# EAGLE schematic esp32_logging (EAGLE 9.6.2)

## Sheet 1 of 2
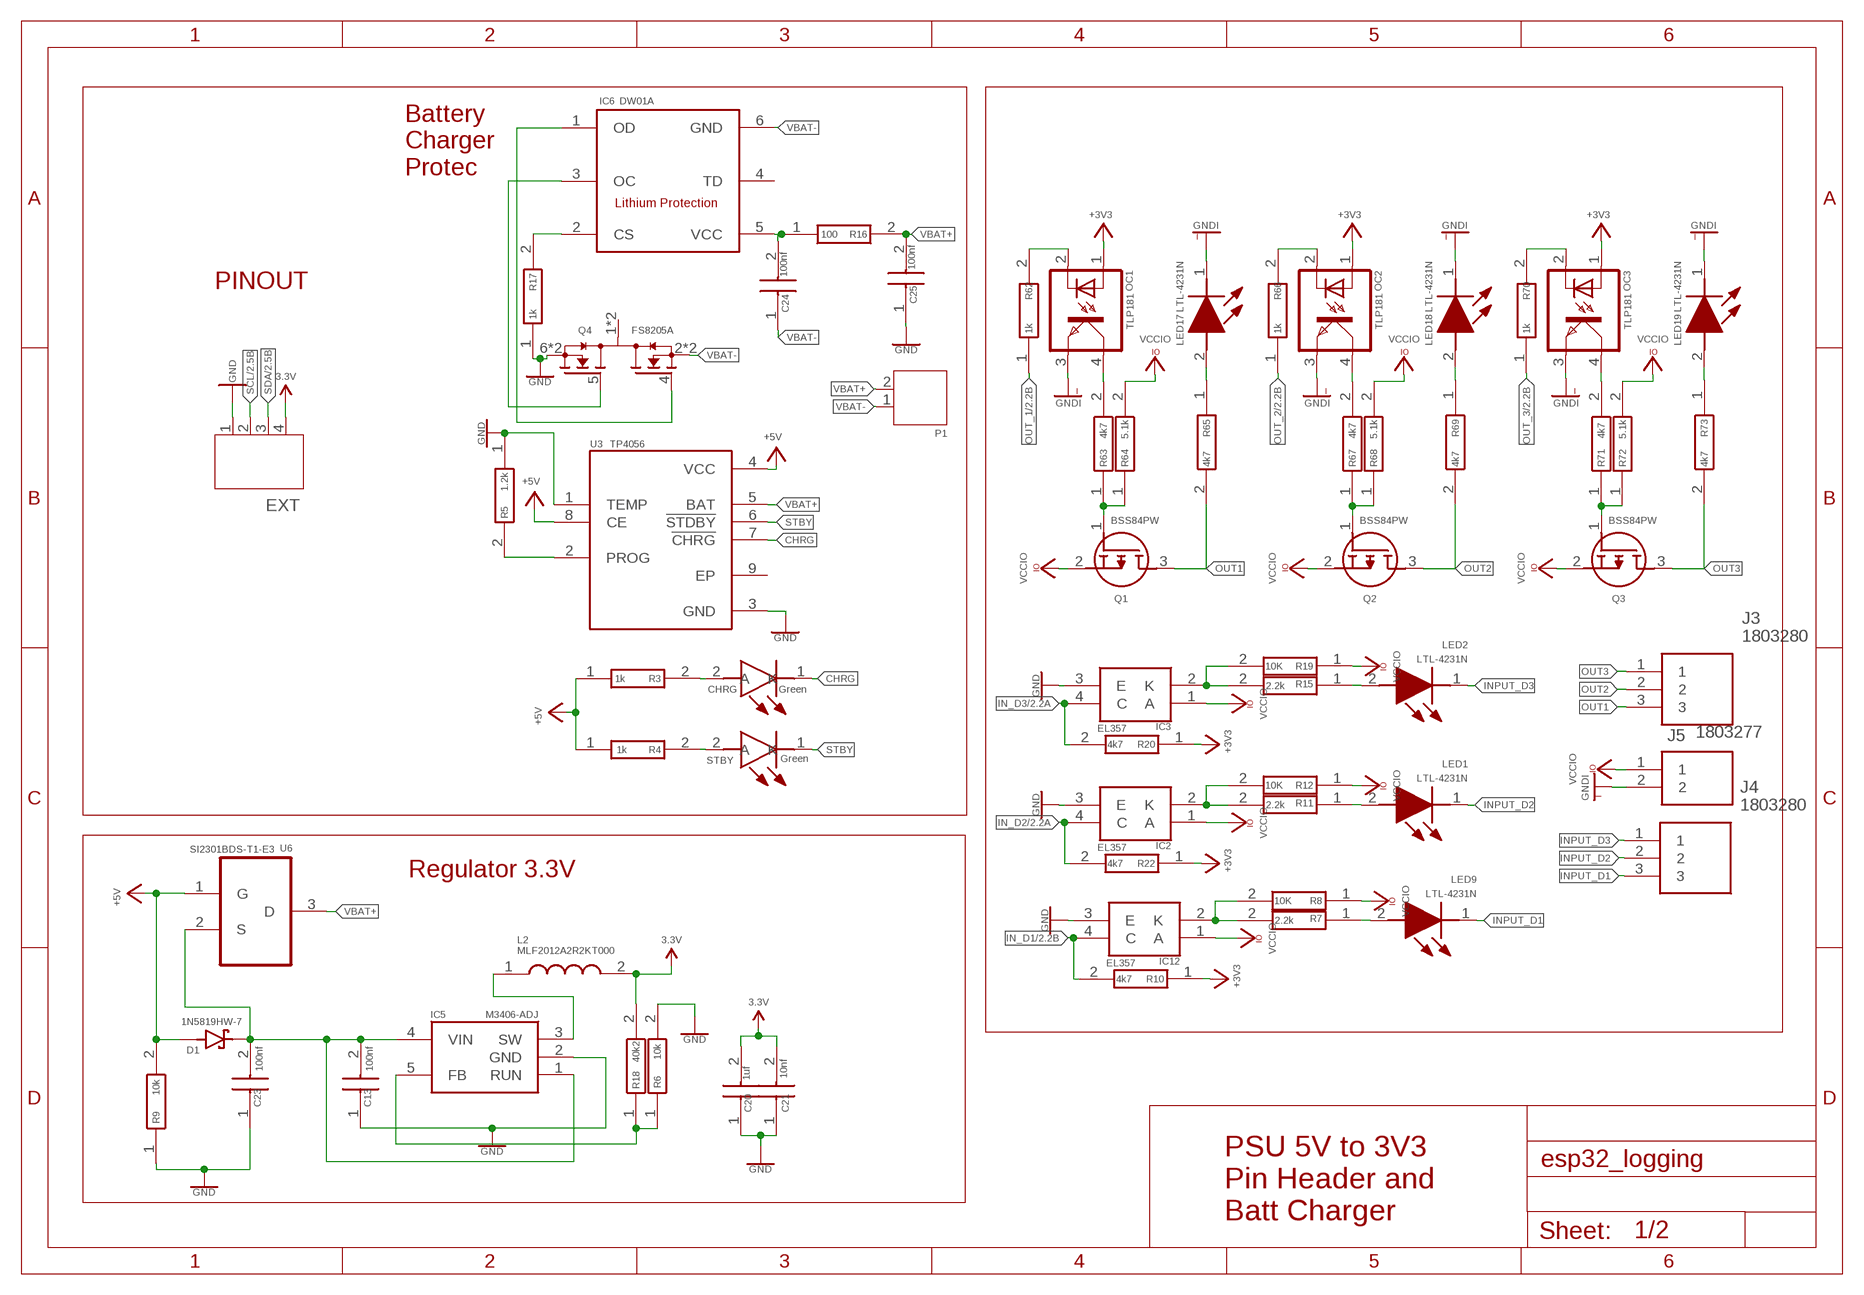
[diagram p0: schematic, sheet 1]

### Parts
C13  100nf  885012206071  [CAPC1608X87N]
C20  1uf  885012206071  [CAPC1608X87N]
C21  10nf  885012206089  [CAPC1608X87N]
C23  100nf  885012206071  [CAPC1608X87N]
C24  100nf  885012206071  [CAPC1608X87N]
C25  100nf  885012206071  [CAPC1608X87N]
CHRG  Green  150080BS75000  [LEDC2012X80N]
D1  1N5819HW-7  [SOD3715X145N]
EXT  JST-PH4  [JST-PH4]
IC2  EL357  [EL357]
IC3  EL357  [EL357]
IC5  M3406-ADJ  [SOT95P280X100-5N]
IC6  DW01A  [SOT23-6]
IC12  EL357  [EL357]
J3  1803280  [1803280]
J4  1803280  [1803280]
J5  1803277  [1803277]
L2  MLF2012A2R2KT000  [INDC2012X105N]
LED1  LTL-4231N  [LTL4231N]
LED2  LTL-4231N  [LTL4231N]
LED9  LTL-4231N  [LTL4231N]
LED17  LTL-4231N  [LTL4231N]
LED18  LTL-4231N  [LTL4231N]
LED19  LTL-4231N  [LTL4231N]
OC1  TLP181  [SO-4]
OC2  TLP181  [SO-4]
OC3  TLP181  [SO-4]
P1  JST-PH2  [JST-PH2]
Q1  BSS84PW  BSS84PW_H6327  [SOT65P210X100-3N]
Q2  BSS84PW  BSS84PW_H6327  [SOT65P210X100-3N]
Q3  BSS84PW  BSS84PW_H6327  [SOT65P210X100-3N]
Q4  FS8205A  [SOP65P640X120-8N]
R3  1k  ESR03EZPJ102  [RESC1608X55N]
R4  1k  ESR03EZPJ102  [RESC1608X55N]
R5  1.2k  ESR03EZPJ102  [RESC1608X55N]
R6  10k  ESR03EZPJ103  [RESC1608X55N]
R7  2.2k  CR0805-FX-2201ELF  [RESC2012X60N]
R8  10K  RT0603DRE0710KL  [RESC1608X55N]
R9  10k  ESR03EZPJ103  [RESC1608X55N]
R10  4k7  ERA-3AED472V  [ERA3AEB101V]
R11  2.2k  CR0805-FX-2201ELF  [RESC2012X60N]
R12  10K  RT0603DRE0710KL  [RESC1608X55N]
R15  2.2k  CR0805-FX-2201ELF  [RESC2012X60N]
R16  100  ESR03EZPJ102  [RESC1608X55N]
R17  1k  ESR03EZPJ102  [RESC1608X55N]
R18  40k2  ERJ-S03F4022V  [RESC1608X55N]
R19  10K  RT0603DRE0710KL  [RESC1608X55N]
R20  4k7  ERA-3AED472V  [ERA3AEB101V]
R22  4k7  ERA-3AED472V  [ERA3AEB101V]
R62  1k  ESR03EZPJ102  [RESC1608X55N]
R63  4k7  ERA-3AED472V  [ERA3AEB101V]
R64  5.1k  ERJ-S03J512V  [RESC1608X55N]
R65  4k7  ERA-3AED472V  [ERA3AEB101V]
R66  1k  ESR03EZPJ102  [RESC1608X55N]
R67  4k7  ERA-3AED472V  [ERA3AEB101V]
R68  5.1k  ERJ-S03J512V  [RESC1608X55N]
R69  4k7  ERA-3AED472V  [ERA3AEB101V]
R70  1k  ESR03EZPJ102  [RESC1608X55N]
R71  4k7  ERA-3AED472V  [ERA3AEB101V]
R72  5.1k  ERJ-S03J512V  [RESC1608X55N]
R73  4k7  ERA-3AED472V  [ERA3AEB101V]
STBY  Green  150080BS75000  [LEDC2012X80N]
U3  TP4056  [SOP127P600X175-9N]
U6  SI2301BDS-T1-E3  [SOT95P237X112-3N]

### Nets
3.3V: C20.2 C21.2 EXT.4 L2.2 OC1.1(A) OC2.1(A) OC3.1(A) R10.1 R18.2 R20.1 R22.1 ; supply symbol labelled +3V3 ; also sheet 2
+5V: D1.A R3.1 R4.1 R9.2 U3.4(VCC) U3.8(CE) U6.1(G) ; also sheet 2
CHRG: CHRG.1(K) U3.7(!CHRG)
GND: C13.1 C20.1 C21.1 C23.1 C25.1 EXT.1 IC2.3(E) IC3.3(E) IC5.2(GND) IC12.3(E) Q4.6(S2) Q4.7(S2) R5.1 R6.2 R9.1 R17.1 U3.1(TEMP) U3.3(GND) ; also sheet 2
GNDI: J5.2 LED17.1(K) LED18.1(K) LED19.1(K) OC1.3(EMIT) OC2.3(EMIT) OC3.3(EMIT)
IN_D1: IC12.4(C) R10.2 ; also sheet 2
IN_D2: IC2.4(C) R22.2 ; also sheet 2
IN_D3: IC3.4(C) R20.2 ; also sheet 2
INPUT_D1: J4.3 LED9.1(K)
INPUT_D2: J4.2 LED1.1(K)
INPUT_D3: J4.1 LED2.1(K)
N$1: C13.2 C23.2 D1.C(K) IC5.1(RUN) IC5.4(VIN) U6.2(S)
N$3: C24.2 IC6.5(VCC) R16.1
N$4: R4.2 STBY.2(A)
N$6: R5.2 U3.2(PROG)
N$8: IC6.1(OD) Q4.4(G1)
N$10: IC5.3(SW) L2.1
N$13: IC2.2(K) R11.2 R12.2
N$14: IC12.2(K) R7.2 R8.2
N$15: CHRG.2(A) R3.2
N$16: LED1.2(A) R11.1
N$17: IC3.2(K) R15.2 R19.2
N$18: LED2.2(A) R15.1
N$20: OC1.4(COL) R63.2
N$21: IC6.2(CS) R17.2
N$22: IC5.5(FB) R6.1 R18.1
N$26: IC6.3(OC) Q4.5(G2)
N$30: OC1.2(C) R62.2
N$31: Q1.1(G) R63.1 R64.1
N$32: OC2.4(COL) R67.2
N$33: LED17.2(A) R65.1
N$35: OC2.2(C) R66.2
N$36: Q2.1(G) R67.1 R68.1
N$37: LED18.2(A) R69.1
N$38: OC3.4(COL) R71.2
N$39: OC3.2(C) R70.2
N$40: Q3.1(G) R71.1 R72.1
N$41: LED19.2(A) R73.1
N$121: LED9.2(A) R7.1
OUT1: J3.3 Q1.3(D) R65.2
OUT2: J3.2 Q2.3(D) R69.2
OUT3: J3.1 Q3.3(D) R73.2
OUT_1: R62.1 ; also sheet 2
OUT_2: R66.1 ; also sheet 2
OUT_3: R70.1 ; also sheet 2
SCL: EXT.2 ; also sheet 2
SDA: EXT.3 ; also sheet 2
STBY: STBY.1(K) U3.6(!STDBY)
VBAT+: C25.2 P1.2 R16.2 U3.5(BAT) U6.3(D)
VBAT-: C24.1 IC6.6(GND) P1.1 Q4.2(S1) Q4.3(S1)
VCCIO: IC2.1(A) IC3.1(A) IC12.1(A) J5.1 Q1.2(S) Q2.2(S) Q3.2(S) R8.1 R12.1 R19.1 R64.2 R68.2 R72.2
Unconnected: IC6.4(TD) Q4.1(D12) Q4.8(D12) U3.9(EP)

### Notes on the sheet
- Battery 
  Charger
  Protec
- PINOUT
- Regulator 3.3V
- PSU 5V to 3V3
  Pin Header and
  Batt Charger

## Sheet 2 of 2
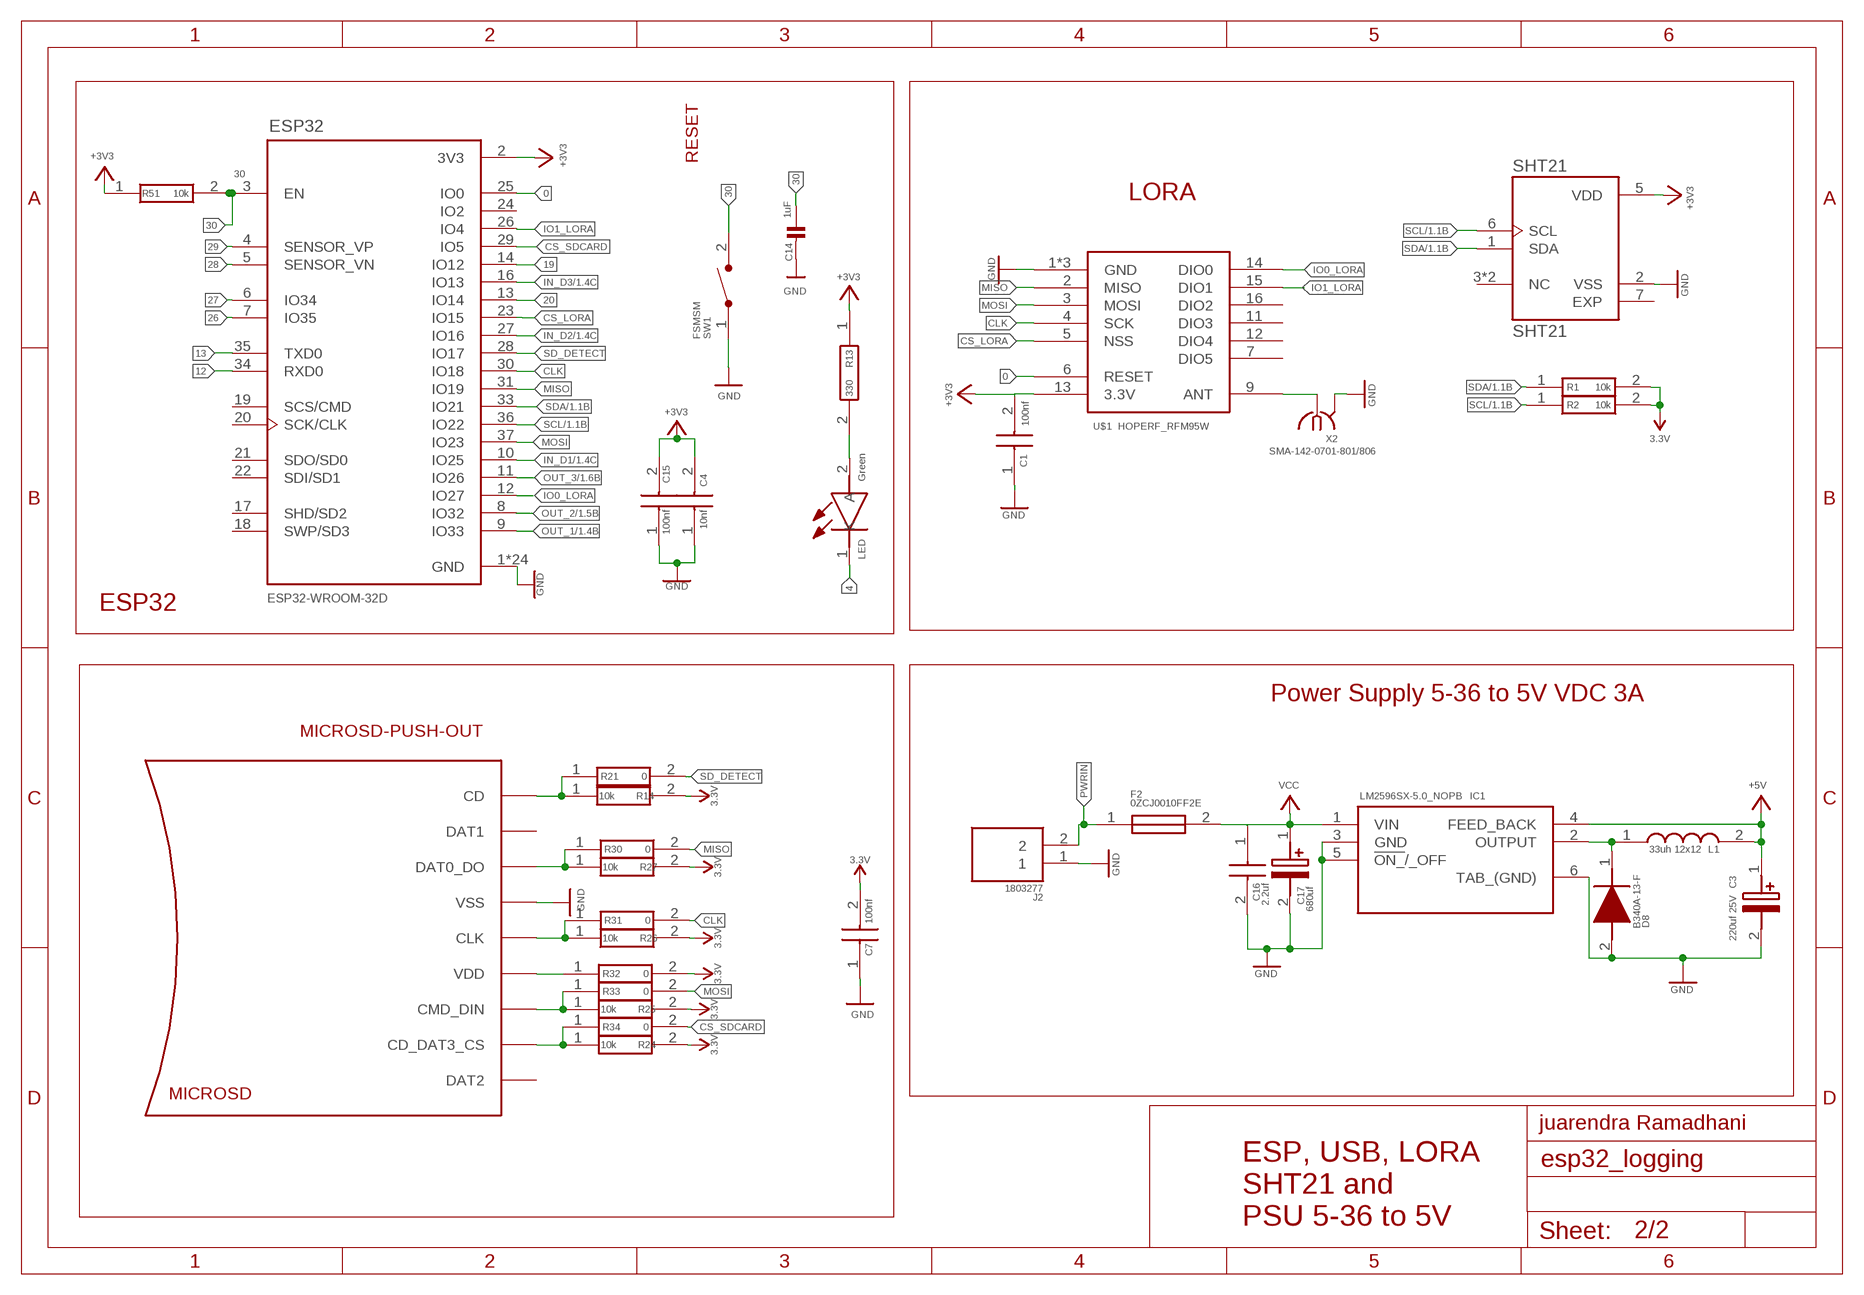
[diagram p1: schematic, sheet 2]

### Parts
C1  100nf  885012206071  [CAPC1608X87N]
C3  220uf 25V  MAL203836221E3  [CAPPRD350W60D850H1250]
C4  10nf  885012206089  [CAPC1608X87N]
C7  100nf  885012206071  [CAPC1608X87N]
C14  1uF  CAP_CERAMIC0603  [0603]
C15  100nf  885012206071  [CAPC1608X87N]
C16  2.2uf  KAF21KR71H225KU  [CAPC2012X140N]
C17  680uf  EEH-ZU1V681UP  [EEHZS1H221P]
D8  B340A-13-F  [DIOM5226X240N]
ESP32  ESP32-WROOM-32D  [MODULE_ESP32-WROOM-32D]
F2  0ZCJ0010FF2E  [FUSC3216X75N]
IC1  LM2596SX-5.0_NOPB  [KTT0005B]
J2  1803277  [1803277]
L1  33uh 12x12  744770133  [WE-PD_1260/1245/1280/121054]
LED  Green  150080BS75000  [LEDC2012X80N]
MICROSD  MICROSD-PUSH-OUT  [MICROSD-PUSH-OUT]
R1  10k  ESR03EZPJ103  [RESC1608X55N]
R2  10k  ESR03EZPJ103  [RESC1608X55N]
R13  330  ERJ-H3EF3300V  [ERJH3]
R14  10k  ESR03EZPJ103  [RESC1608X55N]
R21  0  RC0603FR-070RL  [RESC1608X55N]
R24  10k  ESR03EZPJ103  [RESC1608X55N]
R25  10k  ESR03EZPJ103  [RESC1608X55N]
R26  10k  ESR03EZPJ103  [RESC1608X55N]
R27  10k  ESR03EZPJ103  [RESC1608X55N]
R30  0  RC0603FR-070RL  [RESC1608X55N]
R31  0  RC0603FR-070RL  [RESC1608X55N]
R32  0  RC0603FR-070RL  [RESC1608X55N]
R33  0  RC0603FR-070RL  [RESC1608X55N]
R34  0  RC0603FR-070RL  [RESC1608X55N]
R51  10k  ESR03EZPJ103  [RESC1608X55N]
SHT21  SHT21  [XDCR_SHT21]
SW1  FSMSM  [FSMSM]
U$1  HOPERF_RFM95W  [HOPERF_RFM95W]
X2  SMA-142-0701-801/806  [J502-ND-142-0701-801/806]

### Nets
0: ESP32.25(IO0) U$1.6(RESET)
3.3V: C1.2 C4.2 C7.2 C15.2 ESP32.2(3V3) R1.2 R2.2 R13.1 R14.2 R24.2 R25.2 R26.2 R27.2 R32.2 R51.1 SHT21.5(VDD) U$1.13(3.3V) ; supply symbol labelled +3V3 ; also sheet 1
4: LED.1(K)
12: ESP32.34(RXD0)
13: ESP32.35(TXD0)
19: ESP32.14(IO12)
20: ESP32.13(IO14)
26: ESP32.7(IO35)
27: ESP32.6(IO34)
28: ESP32.5(SENSOR_VN)
29: ESP32.4(SENSOR_VP)
30: C14.1 ESP32.3(EN) R51.2 SW1.2
+5V: C3.1(+) IC1.4(FEED_BACK) L1.2 ; also sheet 1
CLK: ESP32.30(IO18) R31.2 U$1.4(SCK)
CS_LORA: ESP32.23(IO15) U$1.5(NSS)
CS_SDCARD: ESP32.29(IO5) R34.2
GND: C1.1 C3.2(-) C4.1 C7.1 C14.2 C15.1 C16.2 C17.2(-) D8.2(A) IC1.3(GND) IC1.5(!ON_!/_OFF) IC1.6(TAB_(GND)) J2.1 MICROSD.6(VSS) MICROSD.G1(VSS) MICROSD.G2(VSS) MICROSD.G3(VSS) MICROSD.G4(VSS) SHT21.2(VSS) SW1.1 U$1.1(GND) U$1.8(GND) U$1.10(GND) X2.G@1 X2.G@2 X2.G@3 X2.G@4 ; also sheet 1
IN_D1: ESP32.10(IO25) ; also sheet 1
IN_D2: ESP32.27(IO16) ; also sheet 1
IN_D3: ESP32.16(IO13) ; also sheet 1
IO0_LORA: ESP32.12(IO27) U$1.14(DIO0)
IO1_LORA: ESP32.26(IO4) U$1.15(DIO1)
MISO: ESP32.31(IO19) R30.2 U$1.2(MISO)
MOSI: ESP32.37(IO23) R33.2 U$1.3(MOSI)
N$2: MICROSD.CD R14.1 R21.1
N$5: MICROSD.7(DAT0_DO) R27.1 R30.1
N$7: U$1.9(ANT) X2.1
N$9: MICROSD.5(CLK) R26.1 R31.1
N$11: MICROSD.3(CMD_DIN) R25.1 R33.1
N$12: MICROSD.2(CD_DAT3_CS) R24.1 R34.1
N$24: D8.1(K) IC1.2(OUTPUT) L1.1
N$29: MICROSD.4(VDD) R32.1
N$34: LED.2(A) R13.2
OUT_1: ESP32.9(IO33) ; also sheet 1
OUT_2: ESP32.8(IO32) ; also sheet 1
OUT_3: ESP32.11(IO26) ; also sheet 1
PWRIN: F2.1 J2.2
SCL: ESP32.36(IO22) R2.1 SHT21.6(SCL) ; also sheet 1
SD_DETECT: ESP32.28(IO17) R21.2
SDA: ESP32.33(IO21) R1.1 SHT21.1(SDA) ; also sheet 1
VCC: C16.1 C17.1(+) F2.2 IC1.1(VIN)
Unconnected: ESP32.17(SHD/SD2) ESP32.18(SWP/SD3) ESP32.19(SCS/CMD) ESP32.20(SCK/CLK) ESP32.21(SDO/SD0) ESP32.22(SDI/SD1) ESP32.24(IO2) MICROSD.1(DAT2) MICROSD.8(DAT1) SHT21.3(NC) SHT21.4(NC) SHT21.7(EXP) U$1.7(DIO5) U$1.11(DIO3) U$1.12(DIO4) U$1.16(DIO2)

### Notes on the sheet
- RESET
- LORA
- ESP32
- Power Supply 5-36 to 5V VDC 3A
- juarendra Ramadhani
- ESP, USB, LORA
  SHT21 and 
  PSU 5-36 to 5V

## Power pins joined to a net without a drawn wire
GND: ESP32.1(GND) ESP32.15(GND) ESP32.38(GND) ESP32.39_1(GND) ESP32.39_2(GND) ESP32.39_3(GND) ESP32.39_4(GND) ESP32.39_5(GND) ESP32.39_6(GND) ESP32.39_7(GND) ESP32.39_8(GND) ESP32.39_9(GND) ESP32.39_10(GND) ESP32.39_11(GND) ESP32.39_12(GND) ESP32.39_13(GND) ESP32.39_14(GND) ESP32.39_15(GND) ESP32.39_16(GND) ESP32.39_17(GND) ESP32.39_18(GND) ESP32.39_19(GND) ESP32.39_20(GND) ESP32.39_21(GND)

## Library data of the parts
C1 C7 C13 C15 C23-C25 = AccesControlNFC:885012206071: Wurth Elektronik 0603 WCAP-CSGP 100nF Ceramic Multilayer Capacitor, 25 V dc, +125C, X7R Dielectric, +/-10% Source: Datasheet <https://katalog.we-online.com/pbs/datasheet/885012206071.pdf>; DESCRIPTION: Wurth Elektronik 0603 WCAP-CSGP 100nF Ceramic Multilayer Capacitor, 25 V dc, +125C, X7R Dielectric, +/-10%; DIGIKEY_PARTNUMBER: 732-7989-1-ND; DIGIKEY_PRICE-STOCK: https://www.digikey.com/product-detail/en/w%C3%BCrth-elektronik/885012206071/732-7989-1-ND/5454616; HEIGHT: 0.87mm; MANUFACTURER_NAME: Wurth Elektronik; MANUFACTURER_PART_NUMBER: 885012206071; MOUSER_PART_NUMBER: 710-885012206071; MOUSER_PRICE-STOCK: https://www.mouser.co.uk/ProductDetail/Wurth-Elektronik/885012206071?qs=0KOYDY2FL2%2FEBQkuHgvarg%3D%3D
C3 = MAL203836221E3:MAL203836221E3: VISHAY - MAL203836221E3 - CAP, 220F, 25V, 20% Source: Datasheet; DESCRIPTION: VISHAY - MAL203836221E3 - CAP, 220F, 25V, 20%; HEIGHT: 12.5mm; MANUFACTURER_NAME: Vishay; MANUFACTURER_PART_NUMBER: MAL203836221E3; MOUSER_PART_NUMBER: 594-MAL203836221E3; MOUSER_PRICE-STOCK: https://www.mouser.co.uk/ProductDetail/Vishay-BC-Components/MAL203836221E3?qs=G99oyVYclWUIwcN6B3qC5w%3D%3D
C4 C21 = AccesControlNFC:885012206089: Wurth Elektronik 0603 WCAP-CSGP 10nF Ceramic Multilayer Capacitor, 50 V dc, +125C, X7R Dielectric, +/-10% Source: Datasheet <https://katalog.we-online.com/pbs/datasheet/885012206089.pdf>; DESCRIPTION: Wurth Elektronik 0603 WCAP-CSGP 10nF Ceramic Multilayer Capacitor, 50 V dc, +125C, X7R Dielectric, +/-10%; DIGIKEY_PARTNUMBER: 732-8007-1-ND; DIGIKEY_PRICE-STOCK: https://www.digikey.com/product-detail/en/w%C3%BCrth-elektronik/885012206089/732-8007-1-ND/5454634; HEIGHT: 0.87mm; MANUFACTURER_NAME: Wurth Elektronik; MANUFACTURER_PART_NUMBER: 885012206089; MOUSER_PART_NUMBER: 710-885012206089; MOUSER_PRICE-STOCK: https://www.mouser.co.uk/ProductDetail/Wurth-Elektronik/885012206089?qs=0KOYDY2FL28GvSbKh319Tw%3D%3D
C14 = microbuilder:CAP_CERAMIC: Ceramic Capacitors 0402 - 0402 Surface Mount Capacitors 16pF 50V 5% [Digikey: 445-4899-2-ND] 18pF 50V 5% [Digikey: 490-1281-2-ND] 22pF 50V 5% [Digikey: 490-1283-2-ND] 68pF 50V 5% [Digikey: 490-1289-2-ND] 0.1uF 10V 10% [Digikey: 490-1318-2-ND] 1.0uF 6.3V 10% [Digikey: 490-1320-2-ND] 0603 - 0603 Surface Mount Capacitors 16 pF 50V 5% [Digikey: 445-5051-2-ND] 22 pF 50V [Digikey: PCC220ACVTR-ND] 33 pF 50V 5% [Digikey: 490-1415-1-ND] 56pF 50V 5% [Digikey: 490-1421-1-ND] 220pF 50V 5% [Digikey: 445-1285-1-ND] 680 pF 50V 2200 pF 50V 5% C0G [Digikey: 445-1297-1-ND] 5600 pF 100V 5% X7R [Digikey: 478-3711-1-ND] 0.1 µF 25V 10% [Digikey: PCC2277TR-ND] 0.22 µF 16V 10% X7R [Digikey: 445-1318-1-ND] 1.0 µF 25V 10% [Digikey: 445-5146-2-ND] 0603 - RF Specific 3pF 250V +/-0.1pF RF [Digikey: 712-1347-1-ND] 18 pF 250V 5% [Digikey: 478-3505-1-ND or 712-1322-1-ND] 56 pF 250V 5% C0G RF [Digikey: 490-4867-1-ND] 68 pF 250V RF [Digikey: 490-4868-1-ND] 0805 - 0805 Surface Mount Capacitors 220 pF 250V 2% RF Ceramic Capacitor [Digikey: 712-1398-1-ND] 1000 pF 50V 2% NP0 Ceramic Capacitor [Digikey: 478-3760-1-ND] 0.1 µF 25V 10% Ceramic Capacitor [Digikey: PCC1828TR-ND] 1.0 µF 16V 10% Ceramic Capacitor[Digikey: 490-1691-2-ND] 10.0 µF 10V 10% Ceramic Capacitor[Digikey: 709-1228-1-ND] 10.0 uF 16V 10% Ceramic Capacitor [Digikey: 478-5165-2-ND] 47 uF 6.3V 20% Ceramic Capacitor [Digikey: 587-1779-1-ND or 399-5506-1-ND] 1206 - 1206 Surface Mount Capacitors 47uF 10V 20% Ceramic Capacitor [Digikey: 490-5528-1-ND or 399-5508-1-ND or 445-6010-1-ND] 100uF 6.3V -20%, +80% Y5V Ceramic Capacitor (Digikey: 490-4512-1-ND, Mouser: 81-GRM31CF50J107ZE1L)
C16 = KAF21KR71H225KU:KAF21KR71H225KU: Multilayer Ceramic Capacitors MLCC - SMD/SMT 50V 2.2uF X7R 0805 10% AEC-Q200 FLEXITERM Source: Datasheet <https://datasheets.kyocera-avx.com/AutoMLCCKAF.pdf>; DESCRIPTION: Multilayer Ceramic Capacitors MLCC - SMD/SMT 50V 2.2uF X7R 0805 10% AEC-Q200 FLEXITERM; HEIGHT: 1.4mm; MANUFACTURER_NAME: Kyocera AVX; MANUFACTURER_PART_NUMBER: KAF21KR71H225KU; MOUSER_PART_NUMBER: 581-KAF21KR71H225KU; MOUSER_PRICE-STOCK: https://www.mouser.co.uk/ProductDetail/KYOCERA-AVX/KAF21KR71H225KU?qs=Jm2GQyTW%2FbjwwNTLmtUMeQ%3D%3D
C17 = EEH-ZU1V681UP:EEH-ZU1V681UP: Conductive Polymer Hybrid Aluminum Electrolytic Capacitor Source: Datasheet <https://industrial.panasonic.com/cdbs/www-data/pdf/RDD0000/ast-ind-280898.pdf>; DESCRIPTION: Conductive Polymer Hybrid Aluminum Electrolytic Capacitor; HEIGHT: 10.5mm; MANUFACTURER_NAME: Panasonic; MANUFACTURER_PART_NUMBER: EEH-ZU1V681UP; MOUSER_PART_NUMBER: 667-EEH-ZU1V681UP; MOUSER_PRICE-STOCK: https://www.mouser.co.uk/ProductDetail/Panasonic/EEH-ZU1V681UP?qs=HoCaDK9Nz5elLexP3akqig%3D%3D
C20 = AccesControlNFC:885012206071: Wurth Elektronik 0603 WCAP-CSGP 100nF Ceramic Multilayer Capacitor, 25 V dc, +125C, X7R Dielectric, +/-10% Source: Datasheet <https://katalog.we-online.com/pbs/datasheet/885012206071.pdf>; DESCRIPTION: Wurth Elektronik 0603 WCAP-CSGP 100nF Ceramic Multilayer Capacitor, 25 V dc, +125C, X7R Dielectric, +/-10%; DIGIKEY_PARTNUMBER: 732-7989-1-ND; DIGIKEY_PRICE-STOCK: https://www.digikey.com/product-detail/en/w%C3%BCrth-elektronik/885012206071/732-7989-1-ND/5454616; HEIGHT: 0.87mm; MANUFACTURER_NAME: Wurth Elektronik; MANUFACTURER_PART_NUMBER: 885012206071; MOUSER_PART_NUMBER: 710-885012206071; MOUSER_PRICE-STOCK: https://www.mouser.co.uk/ProductDetail/Wurth-Elektronik/885012206071?qs=0KOYDY2FL2%2FEBQkuHgvarg%3D%3D; VALUE: 100nf
CHRG LED STBY = AccesControlNFC:150080BS75000: LED,Wurth Elektronik,150080BS75000 Wurth Elektronik 150080BS75000, WL-SMCW Series Blue LED, 470 nm 2012 (0805) Clear, Rectangle Lens SMD package Source: Datasheet <https://katalog.we-online.com/led/datasheet/150080BS75000.pdf>; DESCRIPTION: LED,Wurth Elektronik,150080BS75000 Wurth Elektronik 150080BS75000, WL-SMCW Series Blue LED, 470 nm 2012 (0805) Clear, Rectangle Lens SMD package; HEIGHT: 0.8mm; MANUFACTURER_NAME: Wurth Elektronik; MANUFACTURER_PART_NUMBER: 150080BS75000; MOUSER_PART_NUMBER: 710-150080BS75000; MOUSER_PRICE-STOCK: https://www.mouser.co.uk/ProductDetail/Wurth-Elektronik/150080BS75000?qs=2kOmHSv6VfT2tBo3UPVqAQ%3D%3D
D1 = 1N5819HW-7:1N5819HW-7: 1N5819HW Series 40 V 1 A Surface Mount Schottky Barrier Rectifier - SOD-123 Check availability <https://pricing.snapeda.com/parts/1N5819HW-7/Diodes%20Inc./view-part?ref=eda>; AVAILABILITY: In Stock; CHECK_PRICES: https://www.snapeda.com/parts/1N5819HW-7/Diodes+Inc./view-part/?ref=eda; DESCRIPTION: Diode Schottky 40 V 1A Surface Mount SOD-123; MF: Diodes Inc.; MP: 1N5819HW-7; PACKAGE: SOD-123 Fairchild Semiconductor; PRICE: None; PURCHASE-URL: https://www.snapeda.com/api/url_track_click_mouser/?unipart_id=51510&manufacturer=Diodes Inc.&part_name=1N5819HW-7&search_term=1n5819; SNAPEDA_LINK: https://www.snapeda.com/parts/1N5819HW-7/Diodes+Inc./view-part/?ref=snap
D8 = B340A-13-F:B340A-13-F: Schottky Diode 3A 40V 0.5Vf SMA Diodes Inc B340A-13-F, SMT Schottky Diode, 40V 3A, 2-Pin DO-214AC Source: Datasheet <https://datasheet.datasheetarchive.com/originals/distributors/Datasheets-305/73551.pdf>; DESCRIPTION: Schottky Diode 3A 40V 0.5Vf SMA Diodes Inc B340A-13-F, SMT Schottky Diode, 40V 3A, 2-Pin DO-214AC; HEIGHT: 2.4mm; MANUFACTURER_NAME: Diodes Incorporated; MANUFACTURER_PART_NUMBER: B340A-13-F; MOUSER_PART_NUMBER: 621-B340A-F; MOUSER_PRICE-STOCK: https://www.mouser.co.uk/ProductDetail/Diodes-Incorporated/B340A-13-F?qs=aLaTXeBcTP9fj%2FYKVo6Q1A%3D%3D
ESP32 = AccesControlNFC:ESP32-WROOM-32D: Bluetooth, WiFi 802.11b/g/n, Bluetooth v4.2 + EDR, Class 1, 2 and 3 Transceiver Module 2.4GHz ~ 2.5GHz Integrated, Trace Surface Mount Check availability <https://pricing.snapeda.com/parts/ESP32-WROOM-32D/Espressif%20Systems/view-part?ref=eda>; AVAILABILITY: In Stock; DESCRIPTION: Bluetooth, WiFi 802.11b/g/n, Bluetooth v4.2 +EDR, Class 1, 2 and 3 Transceiver Module 2.4GHz ~ 2.5GHz Integrated; MF: Espressif Systems; MP: ESP32-WROOM-32D; PACKAGE: Module Espressif Systems; PRICE: None; PURCHASE-URL: https://pricing.snapeda.com/search/part/ESP32-WROOM-32D/?ref=eda
EXT = jst-ph:JST-PH4
F2 = 0ZCJ0010FF2E:0ZCJ0010FF2E: Resettable Fuses - PPTC Fuse Source: Datasheet <https://componentsearchengine.com/Datasheets/1/0ZCJ0010FF2E.pdf>; DESCRIPTION: Resettable Fuses - PPTC Fuse; HEIGHT: 0.75mm; MANUFACTURER_NAME: BelFuse; MANUFACTURER_PART_NUMBER: 0ZCJ0010FF2E; MOUSER_PART_NUMBER: 530-0ZCJ0010FF2E; MOUSER_PRICE-STOCK: https://www.mouser.co.uk/ProductDetail/Bel-Fuse/0ZCJ0010FF2E?qs=SRYZG9HaIQ2ZPdy0ahZ08g%3D%3D
IC1 = LM2596SX-5.0_NOPB:LM2596SX-5.0_NOPB: SIMPLE SWITCHER® 4.5V to 40V, 3A Low Component Count Step-Down Regulator Source: Datasheet <http://www.ti.com/lit/gpn/lm2596>; DESCRIPTION: SIMPLE SWITCHER&#174; 4.5V to 40V, 3A Low Component Count Step-Down Regulator; HEIGHT: mm; MANUFACTURER_NAME: Texas Instruments; MANUFACTURER_PART_NUMBER: LM2596SX-5.0/NOPB; MOUSER_PART_NUMBER: 926-LM2596SX-5.0NOPB; MOUSER_PRICE-STOCK: https://www.mouser.co.uk/ProductDetail/Texas-Instruments/LM2596SX-5.0-NOPB?qs=X1J7HmVL2ZGZ5T4VcWdmNw%3D%3D
IC2 IC3 IC12 = EL357:EL357: Transistor Output Optocouplers 50-600CTR 3750Vrms -55 to +110 Op Temp Source: Datasheet <https://www.digchip.com/datasheets/parts/datasheet/158/EL357-pdf.php>; DESCRIPTION: Transistor Output Optocouplers 50-600CTR 3750Vrms -55 to +110 Op Temp; HEIGHT: 2.6mm; MANUFACTURER_NAME: Everlight; MANUFACTURER_PART_NUMBER: EL357; MOUSER_PART_NUMBER: 638-EL357; MOUSER_PRICE-STOCK: https://www.mouser.co.uk/ProductDetail/Everlight/EL357?qs=EsvJhH3KfjAmHQZnt6ED2Q%3D%3D
IC5 = M3406:M3406-ADJ: Step-down type SOT-23-5 DC-DC Converters ROHS Source: Datasheet <https://www.lcsc.com/datasheet/lcsc_datasheet_2304140030_XI-AN-Aerosemi-Tech-M3406-ADJ_C83224.pdf>; DESCRIPTION: Step-down type SOT-23-5 DC-DC Converters ROHS; HEIGHT: 1mm; LCSC_PART_NUMBER: C83224; LCSC_PRICE-STOCK: https://www.lcsc.com/product-detail/DC-DC-Converters_XI-AN-Aerosemi-Tech-M3406-ADJ_C83224.html; MANUFACTURER_NAME: XI'AN Aerosemi Tech; MANUFACTURER_PART_NUMBER: M3406-ADJ
IC6 = DW01A:DW01A: Check availability <https://pricing.snapeda.com/parts/DW01A/Fortune%20Semiconductor/view-part?ref=eda>; AVAILABILITY: Not in stock; CHECK_PRICES: https://www.snapeda.com/parts/DW01A/Fortune+Semiconductor/view-part/?ref=eda; DESCRIPTION: One Cell Lithium-ion/Polymer Battery Protection IC; MF: Fortune Semiconductor; MP: DW01A; PACKAGE: SOT-23-6 Fortune Semiconductor; PRICE: None; SNAPEDA_LINK: https://www.snapeda.com/parts/DW01A/Fortune+Semiconductor/view-part/?ref=snap
J2 J5 = AccesControlNFC:1803277: PCB header, nominal cross section: 1.5 mm?, color: green, nominal current: 8 A, rated voltage (III/2): 160 V, contact surface: Tin, type of contact: Male connector, Number of potentials: 2, Number of rows: 1, Number of positions per row: 2, number of connections: 2, product range: MC 1,5/..-G, pitch: 3.81 mm, mounting: Wave soldering, pin layout: Linear pinning, solder pin [P]: 3.4 mm, Stecksystem: MINI COMBICON, Locking: without, type of packaging: packed in cardboard Source: Datasheet <http://www.phoenixcontact.com/gb/produkte/1803277>; DESCRIPTION: PCB header, nominal cross section: 1.5 mm?, color: green, nominal current: 8 A, rated voltage (III/2): 160 V, contact surface: Tin, type of contact: Male connector, Number of potentials: 2, Number of rows: 1, Number of positions per row: 2, number of connections: 2, product range: MC 1,5/..-G, pitch: 3.81 mm, mounting: Wave soldering, pin layout: Linear pinning, solder pin [P]: 3.4 mm, Stecksystem: MINI COMBICON, Locking: without, type of packaging: packed in cardboard; HEIGHT: 8.25mm; MANUFACTURER_NAME: Phoenix Contact; MANUFACTURER_PART_NUMBER: 1803277; MOUSER_PART_NUMBER: 651-1803277; MOUSER_PRICE-STOCK: https://www.mouser.co.uk/ProductDetail/Phoenix-Contact/1803277?qs=8BCRtFWWXOQYeqQFCAtgBw%3D%3D
J3 J4 = AccesControlNFC:1803280: PCB header, nominal cross section: 1.5 mm?, color: green, nominal current: 8 A, rated voltage (III/2): 160 V, contact surface: Tin, type of contact: Male connector, Number of potentials: 3, Number of rows: 1, Number of positions per row: 3, number of connections: 3, product range: MC 1,5/..-G, pitch: 3.81 mm, mounting: Wave soldering, pin layout: Linear pinning, solder pin [P]: 3.4 mm, Stecksystem: MINI COMBICON, Locking: without, type of packaging: packed in cardboard Source: Datasheet <http://www.phoenixcontact.com/gb/produkte/1803280>; DESCRIPTION: PCB header, nominal cross section: 1.5 mm?, color: green, nominal current: 8 A, rated voltage (III/2): 160 V, contact surface: Tin, type of contact: Male connector, Number of potentials: 3, Number of rows: 1, Number of positions per row: 3, number of connections: 3, product range: MC 1,5/..-G, pitch: 3.81 mm, mounting: Wave soldering, pin layout: Linear pinning, solder pin [P]: 3.4 mm, Stecksystem: MINI COMBICON, Locking: without, type of packaging: packed in cardboard; HEIGHT: 7.4mm; MANUFACTURER_NAME: Phoenix Contact; MANUFACTURER_PART_NUMBER: 1803280; MOUSER_PART_NUMBER: 651-1803280; MOUSER_PRICE-STOCK: https://www.mouser.co.uk/ProductDetail/Phoenix-Contact/1803280?qs=wd%252Bw3mUqFrn4%252Bd94GrInMA%3D%3D
L1 = 744770133:744770133: Wurth WE-PD Series Shielded Wire-wound SMD Inductor with a Ferrite Core, 33 uH +/-20% 3.6A Idc Source: Datasheet; DESCRIPTION: Wurth WE-PD Series Shielded Wire-wound SMD Inductor with a Ferrite Core, 33 uH +/-20% 3.6A Idc; HEIGHT: mm; MANUFACTURER_NAME: Wurth Elektronik; MANUFACTURER_PART_NUMBER: 744770133; MOUSER_PART_NUMBER: 710-744770133; MOUSER_PRICE-STOCK: https://www.mouser.co.uk/ProductDetail/Wurth-Elektronik/744770133?qs=E%2F%2FhvbtCqpPKkGJl8TxFXw%3D%3D
L2 = MLF2012A2R2KT000:MLF2012A2R2KT000: 2.2 H Shielded Multilayer Inductor 50 mA 500mOhm Max 0805 (2012 Metric) Source: Datasheet <https://product.tdk.com/system/files/dam/doc/product/inductor/inductor/smd/catalog/inductor_commercial_standard_mlf2012_en.pdf>; DESCRIPTION: 2.2 H Shielded Multilayer Inductor 50 mA 500mOhm Max 0805 (2012 Metric); HEIGHT: 1.05mm; MANUFACTURER_NAME: TDK; MANUFACTURER_PART_NUMBER: MLF2012A2R2KT000; MOUSER_PART_NUMBER: 810-MLF2012A2R2KT000; MOUSER_PRICE-STOCK: https://www.mouser.co.uk/ProductDetail/TDK/MLF2012A2R2KT000?qs=pLY5GE0xrmL3Y2Jw%2FEGjFg%3D%3D
LED1 LED2 LED9 LED17-LED19 = Raritan Digital IO:LTL-4231N: Standard LEDs - Through Hole Green Diffused Source: Datasheet; DESCRIPTION: Standard LEDs - Through Hole Green Diffused; HEIGHT: 5.85mm; MANUFACTURER_NAME: Lite-On; MANUFACTURER_PART_NUMBER: LTL-4231N; MOUSER_PART_NUMBER: 859-LTL-4231N; MOUSER_PRICE-STOCK: https://www.mouser.co.uk/ProductDetail/Lite-On/LTL-4231N?qs=oLrYLJP4K4kcthYR8o5Wlw%3D%3D
MICROSD = microsd:MICROSD-PUSH-OUT: T-Flash Push-Out Micro SD Card Reader 14.75mm x 14.5mm SMD with external pins
OC1-OC3 = TLP181:TLP181: Check availability <https://pricing.snapeda.com/parts/TLP181/Toshiba%20Semiconductor/view-part?ref=eda>; AVAILABILITY: In Stock; CHECK_PRICES: https://www.snapeda.com/parts/TLP181/Toshiba+Semiconductor+and+Storage/view-part/?ref=eda; DESCRIPTION: Optoisolator Transistor Output 3750Vrms 1 Channel 6-MFSOP, 4 Lead; MF: Toshiba Semiconductor; MP: TLP181; PACKAGE: SMD-6 Toshiba Semiconductor and Storage; PRICE: None; SNAPEDA_LINK: https://www.snapeda.com/parts/TLP181/Toshiba+Semiconductor+and+Storage/view-part/?ref=snap
P1 = jst-ph:JST-PH2
Q1-Q3 = BSS84PW_H6327:BSS84PW_H6327: MOSFET P-Ch -60V 150mA SOT-323-3 Source: Datasheet <https://www.infineon.com/dgdl/Infineon-BSS84PW-DS-v02_00-EN.pdf?fileId=db3a3043321e49940132482056d32474>; DESCRIPTION: MOSFET P-Ch -60V 150mA SOT-323-3; HEIGHT: 1mm; MANUFACTURER_NAME: Infineon; MANUFACTURER_PART_NUMBER: BSS84PW H6327; MOUSER_PART_NUMBER: 726-BSS84PWH6327; MOUSER_PRICE-STOCK: https://www.mouser.co.uk/ProductDetail/Infineon-Technologies/BSS84PW-H6327?qs=TI%2F9gtmDCEF25mXC5lh2OQ%3D%3D
Q4 = FS8205A:FS8205A: N/A Check availability <https://pricing.snapeda.com/parts/FS8205A/Fortune%20Semiconductor/view-part?ref=eda>; AVAILABILITY: Not in stock; CHECK_PRICES: https://www.snapeda.com/parts/FS8205A/Fortune+Semiconductor/view-part/?ref=eda; MF: Fortune Semiconductor; MP: FS8205A; PACKAGE: Package; PRICE: None; SNAPEDA_LINK: https://www.snapeda.com/parts/FS8205A/Fortune+Semiconductor/view-part/?ref=snap
R1 R2 R6 R9 R14 R24-R27 R51 = AccesControlNFC:ESR03EZPJ103: Thick Film Resistors - SMD 0603 10Kohm 5% Anti Surge AEC-Q200 Source: Datasheet <https://componentsearchengine.com/Datasheets/1/ESR03EZPJ103.pdf>; DESCRIPTION: Thick Film Resistors - SMD 0603 10Kohm 5% Anti Surge AEC-Q200; DIGIKEY_PARTNUMBER: RHM10KDCT-ND; DIGIKEY_PRICE-STOCK: https://www.digikey.com/product-detail/en/rohm-semiconductor/ESR03EZPJ103/RHM10KDCT-ND/1762925; HEIGHT: 0.55mm; MANUFACTURER_NAME: ROHM Semiconductor; MANUFACTURER_PART_NUMBER: ESR03EZPJ103; MOUSER_PART_NUMBER: 755-ESR03EZPJ103; MOUSER_PRICE-STOCK: https://www.mouser.com/Search/Refine.aspx?Keyword=755-ESR03EZPJ103
R3 R4 R17 R62 R66 R70 = AccesControlNFC:ESR03EZPJ102: Thick Film Resistors - SMD 0603 1Kohm 5% Anti Surge AEC-Q200 Source: Datasheet <http://www.rohm.com/web/global/datasheet/ESR01MZPF/esr-e>; DESCRIPTION: Thick Film Resistors - SMD 0603 1Kohm 5% Anti Surge AEC-Q200; DIGIKEY_PARTNUMBER: RHM1.0KDCT-ND; DIGIKEY_PRICE-STOCK: https://www.digikey.com/product-detail/en/rohm-semiconductor/ESR03EZPJ102/RHM1-0KDCT-ND/1762924; HEIGHT: 0.55mm; MANUFACTURER_NAME: ROHM Semiconductor; MANUFACTURER_PART_NUMBER: ESR03EZPJ102; MOUSER_PART_NUMBER: 755-ESR03EZPJ102; MOUSER_PRICE-STOCK: https://www.mouser.co.uk/ProductDetail/ROHM-Semiconductor/ESR03EZPJ102?qs=DyUWGjl%252BcVvjMuV%252BzioV7Q%3D%3D
R5 R16 = AccesControlNFC:ESR03EZPJ102: Thick Film Resistors - SMD 0603 1Kohm 5% Anti Surge AEC-Q200 Source: Datasheet <http://www.rohm.com/web/global/datasheet/ESR01MZPF/esr-e>; DESCRIPTION: Thick Film Resistors - SMD 0603 1Kohm 5% Anti Surge AEC-Q200; DIGIKEY_PARTNUMBER: RHM1.0KDCT-ND; DIGIKEY_PRICE-STOCK: https://www.digikey.com/product-detail/en/rohm-semiconductor/ESR03EZPJ102/RHM1-0KDCT-ND/1762924; HEIGHT: 0.55mm; MANUFACTURER_NAME: ROHM Semiconductor; MANUFACTURER_PART_NUMBER: ESR03EZPJ102; MOUSER_PART_NUMBER: 755-ESR03EZPJ102; MOUSER_PRICE-STOCK: https://www.mouser.co.uk/ProductDetail/ROHM-Semiconductor/ESR03EZPJ102?qs=DyUWGjl%252BcVvjMuV%252BzioV7Q%3D%3D; VALUE: 1k
R7 R11 R15 = CR0805-FX-2201ELF:CR0805-FX-2201ELF: BOURNS - CR0805-FX-2201ELF - RES, THICK FILM, 2K2, 1%, 0.125W, 0805 Source: Datasheet <https://www.bourns.com/pdfs/chpreztr.pdf>; DESCRIPTION: BOURNS - CR0805-FX-2201ELF - RES, THICK FILM, 2K2, 1%, 0.125W, 0805; HEIGHT: 0.6mm; MANUFACTURER_NAME: Bourns; MANUFACTURER_PART_NUMBER: CR0805-FX-2201ELF; MOUSER_PART_NUMBER: 652-CR0805FX-2201ELF; MOUSER_PRICE-STOCK: https://www.mouser.co.uk/ProductDetail/Bourns/CR0805-FX-2201ELF?qs=Woncl1%2FcWdhqe6ZSJY8Gqw%3D%3D
R8 R12 R19 = Raritan Digital IO:RT0603DRE0710KL: Thin Film Resistors - SMD 10K ohm 0.5% 1/10W Source: Datasheet <https://datasheet.datasheetarchive.com/originals/distributors/Datasheets_SAMA/a1f8f48f216d234b3e6a96d43a77a0c1.pdf>; DESCRIPTION: Thin Film Resistors - SMD 10K ohm 0.5% 1/10W; HEIGHT: 0.55mm; MANUFACTURER_NAME: YAGEO (PHYCOMP); MANUFACTURER_PART_NUMBER: RT0603DRE0710KL
R10 R20 R22 R63 R65 R67 R69 R71 R73 = ERA-3AED472V:ERA-3AED472V: Thin Film Resistors - SMD 0603 4700ohms 25ppm 0.5% AEC-Q200 Source: Datasheet <https://industrial.panasonic.com/cdbs/www-data/pdf/RDM0000/AOA0000C307.pdf>; DESCRIPTION: Thin Film Resistors - SMD 0603 4700ohms 25ppm 0.5% AEC-Q200; HEIGHT: 0.55mm; MANUFACTURER_NAME: Panasonic; MANUFACTURER_PART_NUMBER: ERA-3AED472V; MOUSER_PART_NUMBER: 667-ERA-3AED472V; MOUSER_PRICE-STOCK: https://www.mouser.co.uk/ProductDetail/Panasonic/ERA-3AED472V?qs=yocZuyCaXdNwFfaWaVzlqg%3D%3D
R13 = AccesControlNFC:ERJ-H3EF3300V: Power Rating 0.125W,Resistance 330 Ohm,LxW(EIA) 1.6 x 0.8 (EIA:0603) mm Source: Datasheet <http://industrial.panasonic.com/cdbs/www-data/pdf/RDQ0000/ast-ind-151033.pdf>; DESCRIPTION: Power Rating 0.125W,Resistance 330 Ohm,LxW(EIA) 1.6 x 0.8 (EIA:0603) mm; HEIGHT: mm; MANUFACTURER_NAME: Panasonic; MANUFACTURER_PART_NUMBER: ERJ-H3EF3300V; MOUSER_PART_NUMBER: 667-ERJ-H3EF3300V; MOUSER_PRICE-STOCK: https://www.mouser.co.uk/ProductDetail/Panasonic/ERJ-H3EF3300V?qs=eP2BKZSCXI61roRLPi8W7w%3D%3D
R18 = ERJ-S03F4022V:ERJ-S03F4022V: Thick Film Resistors - SMD 0603 40.2Kohms 1% Anti-Sulfur Source: Datasheet <https://componentsearchengine.com/Datasheets/1/ERJ-S03F4022V.pdf>; DESCRIPTION: Thick Film Resistors - SMD 0603 40.2Kohms 1% Anti-Sulfur; HEIGHT: 0.55mm; MANUFACTURER_NAME: Panasonic; MANUFACTURER_PART_NUMBER: ERJ-S03F4022V; MOUSER_PART_NUMBER: 667-ERJ-S03F4022V; MOUSER_PRICE-STOCK: https://www.mouser.com/Search/Refine.aspx?Keyword=667-ERJ-S03F4022V
R21 R30-R34 = RC0603FR-070RL:RC0603FR-070RL: YAGEO - RC0603FR-070RL - Zero Ohm Resistor, Jumper, 0603 [1608 Metric], Thick Film, 100 mW, 1 A, Surface Mount Device Source: Datasheet <https://componentsearchengine.com/Datasheets/2/RC0603FR-070RL.pdf>; DESCRIPTION: YAGEO - RC0603FR-070RL - Zero Ohm Resistor, Jumper, 0603 [1608 Metric], Thick Film, 100 mW, 1 A, Surface Mount Device; HEIGHT: 0.55mm; MANUFACTURER_NAME: YAGEO; MANUFACTURER_PART_NUMBER: RC0603FR-070RL; MOUSER_PART_NUMBER: 603-RC0603FR-070RL; MOUSER_PRICE-STOCK: https://www.mouser.co.uk/ProductDetail/YAGEO/RC0603FR-070RL?qs=0yPvnVz5%2FmpDQv43TwvCfw%3D%3D
R64 R68 R72 = ERJ-S03J512V:ERJ-S03J512V: Thick Film Resistors - SMD 0603 5.1Kohms 5% Anti-Sulfur Source: Datasheet <https://industrial.panasonic.com/cdbs/www-data/pdf/RDP0000/AOA0000C334.pdf>; DESCRIPTION: Thick Film Resistors - SMD 0603 5.1Kohms 5% Anti-Sulfur; HEIGHT: 0.55mm; MANUFACTURER_NAME: Panasonic; MANUFACTURER_PART_NUMBER: ERJ-S03J512V; MOUSER_PART_NUMBER: 667-ERJ-S03J512V; MOUSER_PRICE-STOCK: https://www.mouser.co.uk/ProductDetail/Panasonic/ERJ-S03J512V?qs=Zyl8A9hlmJqAFT0b3tVqcA%3D%3D
SHT21 = SHT21:SHT21: Check availability <https://pricing.snapeda.com/parts/SHT21/Sensirion%20AG/view-part?ref=eda>; AVAILABILITY: In Stock; CHECK_PRICES: https://www.snapeda.com/parts/SHT21/Sensirion+AG/view-part/?ref=eda; DESCRIPTION: SENSOR HUMID/TEMP 3V I2C 2% SMD; MF: Sensirion AG; MP: SHT21; PACKAGE: DFN-6 Sensirion; PRICE: None; PURCHASE-URL: https://www.snapeda.com/api/url_track_click_mouser/?unipart_id=46060&manufacturer=Sensirion AG&part_name=SHT21&search_term=None; SNAPEDA_LINK: https://www.snapeda.com/parts/SHT21/Sensirion+AG/view-part/?ref=snap
SW1 = Switch:FSMSM: SWITCH TACTILE SPST-NO 0.05A 24V Manufacturer's datasheet <https://www.te.com/commerce/DocumentDelivery/DDEController?Action=srchrtrv&DocNm=1437566-3&DocType=Customer+Drawing&DocLang=English>; CREATED_BY: PCBLayout.com; DIGIKEY_PART_NUMBER: 450-1140-ND; MANUFACTURER: TE Connectivity ALCOSWITCH Switches; MPN: FSMSM
U3 = TP4056:TP4056: Complete single cell Li-Ion battery with a constant current / constant voltage linear charger Check availability <https://pricing.snapeda.com/parts/TP4056/NanJing%20Top%20Power%20ASIC%20Corp./view-part?ref=eda>; AVAILABILITY: Not in stock; CHECK_PRICES: https://www.snapeda.com/parts/TP4056/NanJing+Top+Power+ASIC+Corp./view-part/?ref=eda; DESCRIPTION: Complete single cell Li-Ion battery with a constant current / constant voltage linear charger; MF: NanJing Top Power ASIC Corp.; MP: TP4056; PACKAGE: Package; PRICE: None; SNAPEDA_LINK: https://www.snapeda.com/parts/TP4056/NanJing+Top+Power+ASIC+Corp./view-part/?ref=snap
U6 = SI2301BDS-T1-E3:SI2301BDS-T1-E3: MOSFET Check availability <https://pricing.snapeda.com/parts/SI2301BDS-T1-E3/Vishay/view-part?ref=eda>; AVAILABILITY: In Stock; CHECK_PRICES: https://www.snapeda.com/parts/SI2301BDS-T1-E3/Vishay+Siliconix/view-part/?ref=eda; DESCRIPTION: MOSFET,P-Ch,VDSS -20V,RDS(ON) 0.08Ohm,ID -2.2A,TO-236 (SOT-23),PD 0.7W,VGS +/-8V | Siliconix / Vishay SI2301BDS-T1-E3; MF: Vishay; MP: SI2301BDS-T1-E3; PACKAGE: SOT-23-3 Vishay Siliconix; PRICE: None; PURCHASE-URL: https://www.snapeda.com/api/url_track_click_mouser/?unipart_id=277675&manufacturer=Vishay&part_name=SI2301BDS-T1-E3&search_term=si2301; SNAPEDA_LINK: https://www.snapeda.com/parts/SI2301BDS-T1-E3/Vishay+Siliconix/view-part/?ref=snap
U$1 = lora-lorawan-modules:HOPERF_RFM95W: HopeRF LoRaWAN modules Link: http://www.hoperf.com/rf_transceiver/lora/; HEIGHT: 1.8; LENGTH: 16; WIDTH: 16
X2 = con-coax:SMA-: SMA 50 Ohm End Launch Jack Receptacle - Round Contact Johnson Components Source: www.johnsoncomponents.com .. J502-ND.pdf; MF: JOHNSON COMPONENTS; MPN: 142-0701-801; OC_FARNELL: 1608592; OC_NEWARK: 90F2624